# EAGLE schematic FluoWiFi_R01-RC (EAGLE 8.2.2)

## Sheet 1 of 2
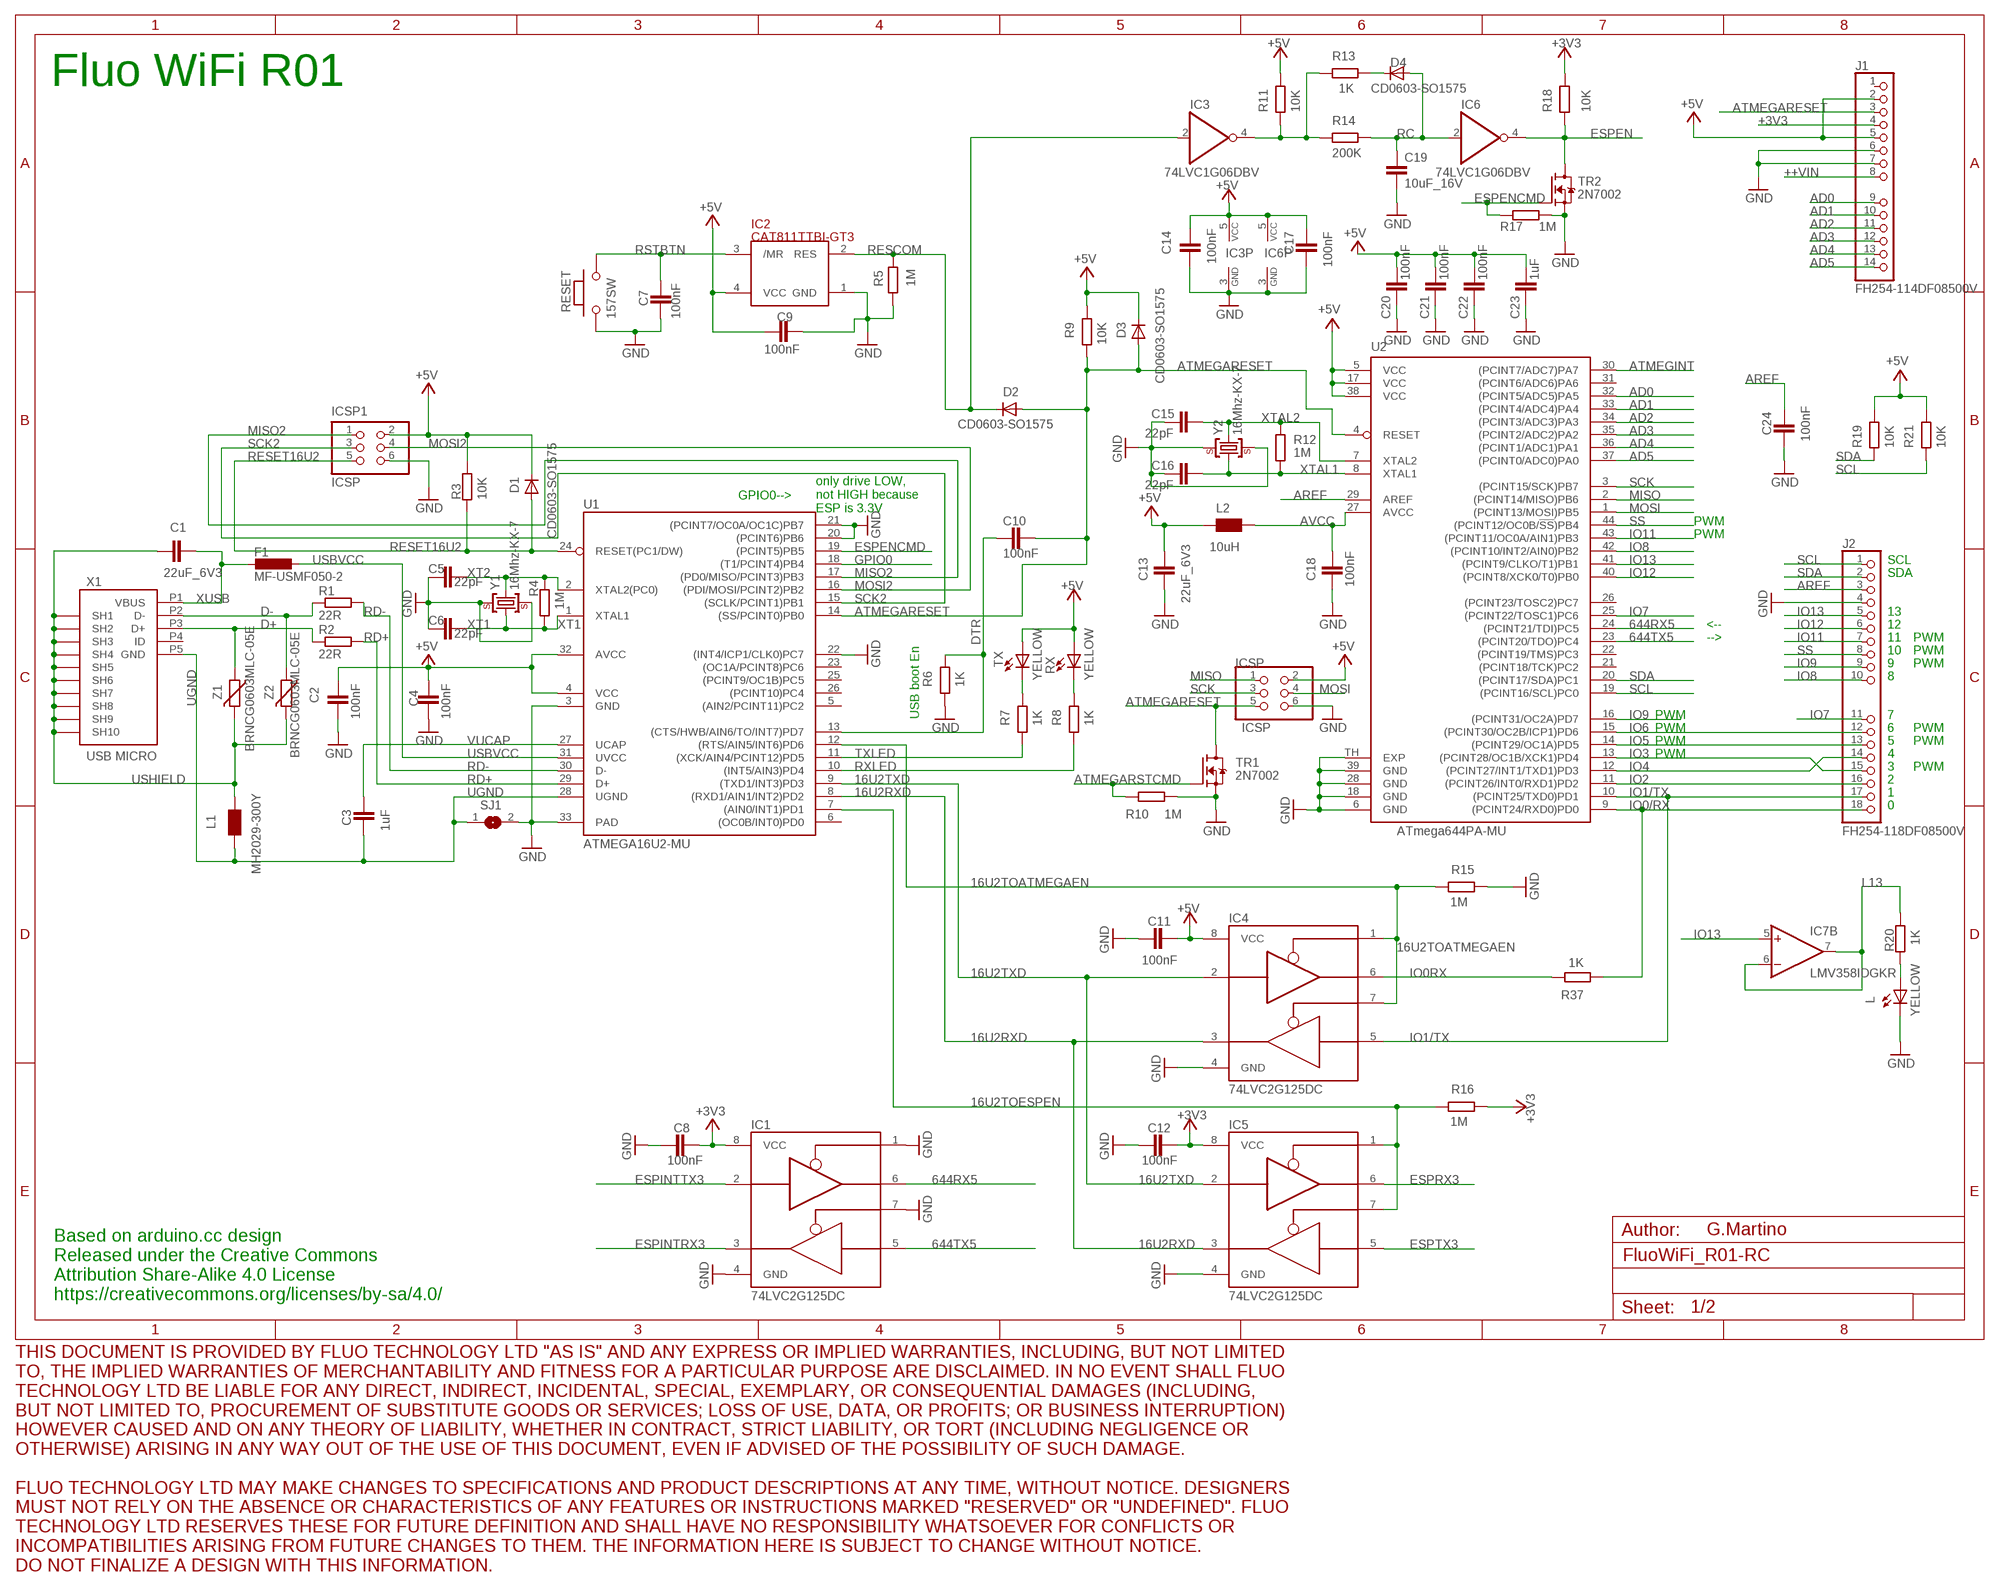
[diagram p0: schematic, sheet 1]

### Parts
C1  22uF_6V3  XXXX_GRM188R60J226MEA0D  [C0603-ROUND]
C2  100nF  0132_100NF_0402  [C0402]
C3  1uF  0133_1UF_0402  [C0402]
C4  100nF  0132_100NF_0402  [C0402]
C5  22pF  0137_22PF_0402  [C0402]
C6  22pF  0137_22PF_0402  [C0402]
C7  100nF  0132_100NF_0402  [C0402]
C8  100nF  0132_100NF_0402  [C0402]
C9  100nF  0132_100NF_0402  [C0402]
C10  100nF  0132_100NF_0402  [C0402]
C11  100nF  0132_100NF_0402  [C0402]
C12  100nF  0132_100NF_0402  [C0402]
C13  22uF_6V3  XXXX_GRM188R60J226MEA0D  [C0603-ROUND]
C14  100nF  0132_100NF_0402  [C0402]
C15  22pF  0137_22PF_0402  [C0402]
C16  22pF  0137_22PF_0402  [C0402]
C17  100nF  0132_100NF_0402  [C0402]
C18  100nF  0132_100NF_0402  [C0402]
C19  10uF_16V  XXXX_10UF_16V_0805C0805_ROUND  [C0805_ROUND]
C20  100nF  0132_100NF_0402  [C0402]
C21  100nF  0132_100NF_0402  [C0402]
C22  100nF  0132_100NF_0402  [C0402]
C23  1uF  0133_1UF_0402  [C0402]
C24  100nF  0132_100NF_0402  [C0402]
D1  CD0603-SO1575  XXXX_CD0603-SO1575  [0603]
D2  CD0603-SO1575  XXXX_CD0603-SO1575  [0603]
D3  CD0603-SO1575  XXXX_CD0603-SO1575  [0603]
D4  CD0603-SO1575  XXXX_CD0603-SO1575  [0603]
F1  MF-USMF050-2  XXXX_MF-USMF050-2  [1210]
IC1  74LVC2G125DC  XXXX_74LVC2G125DC  [VSSOP8]
IC2  CAT811TTBI-GT3  0035_CAT811TTBI-GT3  [SOT143]
IC3  74LVC1G06DBV  [SOT23-5]
IC4  74LVC2G125DC  XXXX_74LVC2G125DC  [VSSOP8]
IC5  74LVC2G125DC  XXXX_74LVC2G125DC  [VSSOP8]
IC6  74LVC1G06DBV  [SOT23-5]
IC7  LMV358IDGKR  0021_LMV358IDGKR  [MSOP08]
ICSP  ICSP  0114_PH254-203DF118A00V  [2X03]
ICSP1  ICSP  0114_PH254-203DF118A00V  [2X03]
J1  FH254-114DF08500V  XXXX_FH254-114DF08500V_FLUO  [1-14-TH-PRESSFIT]
J2  FH254-118DF08500V  XXXX_FH254-118DF08500V_FLUO  [1X18-TH-PRESSFIT]
L  YELLOW  XXXX_KPHHS-1005SYCK  [0402_CHIP_LED]
L1  MH2029-300Y  0001_BLM21PG300SN1D_/_MH2029-300Y  [0805]
L2  10uH  0715_CV201210-100K  [0805]
R1  22R  0468_22R_0402  [R0402]
R2  22R  0468_22R_0402  [R0402]
R3  10K  0136_CR0402FX1002_L  [R0402]
R4  1M  0139_1M_0402  [R0402]
R5  1M  0139_1M_0402  [R0402]
R6  1K  0140_1K_0402  [R0402]
R7  1K  0140_1K_0402  [R0402]
R8  1K  0140_1K_0402  [R0402]
R9  10K  0136_CR0402FX1002_L  [R0402]
R10  1M  0139_1M_0402  [R0402]
R11  10K  0136_CR0402FX1002_L  [R0402]
R12  1M  0139_1M_0402  [R0402]
R13  1K  0140_1K_0402  [R0402]
R14  200K  XXXX_CRT0402-BY-2003GLF  [R0402]
R15  1M  0139_1M_0402  [R0402]
R16  1M  0139_1M_0402  [R0402]
R17  1M  0139_1M_0402  [R0402]
R18  10K  0136_CR0402FX1002_L  [R0402]
R19  10K  0136_CR0402FX1002_L  [R0402]
R20  1K  0140_1K_0402  [R0402]
R21  10K  0136_CR0402FX1002_L  [R0402]
R37  1K  0140_1K_0402  [R0402]
RESET  157SW  0173_IT-1185AP1C-160G-G_T&R  [SMD_157SW]
RX  YELLOW  XXXX_KPHHS-1005SYCK  [0402_CHIP_LED]
SJ1  SJSJ_NO_RESIST  [SJ_NO_RESIST]
TR1  2N7002  1612_2N7002LT1G  [SOT-23]
TR2  2N7002  1612_2N7002LT1G  [SOT-23]
TX  YELLOW  XXXX_KPHHS-1005SYCK  [0402_CHIP_LED]
U1  ATMEGA16U2-MU  0007_ATMEGA16U2-MUR  [MLF32]
U2  ATmega644PA-MU  XXXX_ATMEGA644PA-MUM  [VQFN44]
U$1  DISCLAIMER-FLUO  [DISCLAIMER-FLUO]
X1  USB MICRO  0158_MCR-B-S-RA-SMT-CS1TR_HOLES  [CON2_USB_MICRO_B_AT_HOLES]
Y1  16Mhz-KX-7  0395_16.000MHZ__12PF  [CRYSTAL-3.2-2.5]
Y2  16Mhz-KX-7  0395_16.000MHZ__12PF  [CRYSTAL-3.2-2.5]
Z1  BRNCG0603MLC-05E  0010_BRNCG0603MLC-05E  [CT/CN0603]
Z2  BRNCG0603MLC-05E  0010_BRNCG0603MLC-05E  [CT/CN0603]

### Nets
16U2RXD: IC4.3(2Y) IC5.3(2Y) U1.8((RXD1/AIN1/INT2)PD2)
16U2TOATMEGAEN: IC4.1(OE1) IC4.7(OE2) R15.2 U1.12((RTS/AIN5/INT6)PD6)
16U2TOESPEN: IC5.1(OE1) IC5.7(OE2) R16.2 U1.7((AIN0/INT1)PD1)
16U2TXD: IC4.2(1A) IC5.2(1A) U1.9((TXD1/INT3)PD3)
644RX5: IC1.6(1Y) U2.24((PCINT21/TDI)PC5)
644TX5: IC1.5(2A) U2.23((PCINT20/TDO)PC4)
+3V3: C8.2 C12.1 IC1.8(VCC) IC5.8(VCC) J1.4 R16.1 R18.2 ; also sheet 2
+5V [usbvcc]: C2.1 C4.2 C9.1 C11.1 C13.2 C14.2 C17.2 C20.2 C21.2 C22.2 C23.1 D1.C D3.C IC2.4(VCC) IC3.5(VCC) IC4.8(VCC) IC6.5(VCC) ICSP1.2 ICSP.2 J1.2 J1.5 L2.1 R3.2 R9.2 R11.2 R19.2 R21.2 RX.A TX.A U1.4(VCC) U1.32(AVCC) U2.5(VCC) U2.17(VCC) U2.38(VCC) ; also sheet 2
++VIN [power]: J1.8 ; also sheet 2
AD0: J1.9 U2.32((PCINT5/ADC5)PA5)
AD1: J1.10 U2.33((PCINT4/ADC4)PA4)
AD2: J1.11 U2.34((PCINT3/ADC3)PA3)
AD3: J1.12 U2.35((PCINT2/ADC2)PA2)
AD4: J1.13 U2.36((PCINT1/ADC1)PA1)
AD5: J1.14 U2.37((PCINT0/ADC0)PA0)
AREF [aref]: C24.2 J2.3 U2.29(AREF)
ATMEGARESET: C10.2 D2.A D3.A ICSP.5 J1.3 R9.1 TR1.3(D) U1.14((SS/PCINT0)PB0) U2.4(RESET)
ATMEGARSTCMD: R10.1 TR1.1(G) ; also sheet 2
ATMEGINT: U2.30((PCINT7/ADC7)PA7) ; also sheet 2
AVCC: C18.2 L2.2 U2.27(AVCC)
D+: R2.1 X1.P3(D+) Z1.1
D-: R1.1 X1.P2(D-) Z2.1
DTR: C10.1 R6.2 U1.13((CTS/HWB/AIN6/TO/INT7)PD7)
ESPEN: IC6.4(O) R18.1 TR2.3(D) ; also sheet 2
ESPENCMD: R17.1 TR2.1(G) U1.19((PCINT5)PB5)
ESPINTRX3: IC1.3(2Y) ; also sheet 2
ESPINTTX3: IC1.2(1A) ; also sheet 2
ESPRX3: IC5.6(1Y) ; also sheet 2
ESPTX3: IC5.5(2A) ; also sheet 2
GND [gnd]: C2.2 C4.1 C5.2 C6.2 C7.1 C8.1 C9.2 C11.2 C12.2 C13.1 C14.1 C15.2 C16.2 C17.1 C18.1 C19.2 C20.1 C21.1 C22.1 C23.2 C24.1 IC1.1(OE1) IC1.4(GND) IC1.7(OE2) IC2.1(GND) IC3.3(GND) IC4.4(GND) IC5.4(GND) IC6.3(GND) ICSP1.6 ICSP.6 J1.6 J1.7 J2.4 L.C R5.1 R6.1 R10.2 R15.1 R17.2 RESET.1 SJ1.2 TR1.2(S) TR2.2(S) U1.3(GND) U1.20((PCINT6)PB6) U1.21((PCINT7/OC0A/OC1C)PB7) U1.22((INT4/ICP1/CLK0)PC7) U1.33(PAD) U2.6(GND) U2.18(GND) U2.28(GND) U2.39(GND) U2.TH(EXP) Y1.2(GND) Y1.4(GND) Y2.2(GND) Y2.4(GND) ; also sheet 2
GPIO0: U1.18((T1/PCINT4)PB4) ; also sheet 2
IO0/RX: J2.18 R37.1 U2.9((PCINT24/RXD0)PD0)
IO0RX: IC4.6(1Y) R37.2
IO1/TX: IC4.5(2A) J2.17 U2.10((PCINT25/TXD0)PD1)
IO2: J2.16 U2.11((PCINT26/INT0/RXD1)PD2)
IO3: J2.15 U2.13((PCINT28/OC1B/XCK1)PD4)
IO4: J2.14 U2.12((PCINT27/INT1/TXD1)PD3)
IO5: J2.13 U2.14((PCINT29/OC1A)PD5)
IO6: J2.12 U2.15((PCINT30/OC2B/ICP1)PD6)
IO7: J2.11 U2.25((PCINT22/TOSC1)PC6)
IO8: J2.10 U2.42((PCINT10/INT2/AIN0)PB2)
IO9: J2.9 U2.16((PCINT31/OC2A)PD7)
IO11: J2.7 U2.43((PCINT11/OC0A/AIN1)PB3)
IO12: J2.6 U2.40((PCINT8/XCK0/T0)PB0)
IO13: IC7.5(B:+IN) J2.5 U2.41((PCINT9/CLKO/T1)PB1)
L13: IC7.6(B:-IN) IC7.7(B:OUT) R20.2
MISO: ICSP.1 U2.2((PCINT14/MISO)PB6) ; also sheet 2
MISO2: ICSP1.1 U1.17((PD0/MISO/PCINT3)PB3)
MOSI: ICSP.4 U2.1((PCINT13/MOSI)PB5) ; also sheet 2
MOSI2: ICSP1.4 U1.16((PDI/MOSI/PCINT2)PB2)
N$6: IC3.4(O) R11.1 R13.1 R14.2
N$7: D4.C R13.2
N$14: R7.2 TX.C
N$15: R8.2 RX.C
N$21: L.A R20.1
RC: C19.1 D4.A IC6.2(I) R14.1
RD+: R2.2 U1.29(D+)
RD-: R1.2 U1.30(D-)
RESCOM: D2.C IC2.2(RES) IC3.2(I) R5.2
RESET16U2: D1.A ICSP1.5 R3.1 U1.24(RESET(PC1/DW))
RSTBTN: C7.2 IC2.3(/MR) RESET.2
RXLED: R8.1 U1.10((INT5/AIN3)PD4)
SCK: ICSP.3 U2.3((PCINT15/SCK)PB7) ; also sheet 2
SCK2: ICSP1.3 U1.15((SCLK/PCINT1)PB1)
SCL: J2.1 R21.1 U2.19((PCINT16/SCL)PC0)
SDA: J2.2 R19.1 U2.20((PCINT17/SDA)PC1)
SS: J2.8 U2.44((PCINT12/OC0B/!SS!)PB4)
TXLED: R7.1 U1.11((XCK/AIN4/PCINT12)PD5)
UGND [gnd]: C3.2 L1.1 SJ1.1 U1.28(UGND) X1.P5(GND)
USBVCC [usbvcc]: F1.1 U1.31(UVCC) ; also sheet 2
USHIELD [usbvcc]: C1.2 L1.2 X1.P$2(SH7) X1.P$3(SH8) X1.P$6(SH9) X1.P$7(SH10) X1.S1(SH1) X1.S2(SH2) X1.S3(SH3) X1.S4(SH4) X1.S5(SH5) X1.S6(SH6) Z1.2 Z2.2
VUCAP: C3.1 U1.27(UCAP)
XT1: C6.1 R4.1 U1.1(XTAL1) Y1.1(C1)
XT2: C5.1 R4.2 U1.2(XTAL2(PC0)) Y1.3(C2)
XTAL1: C16.1 R12.1 U2.8(XTAL1) Y2.1(C1)
XTAL2: C15.1 R12.2 U2.7(XTAL2) Y2.3(C2)
XUSB [usbvcc]: C1.1 F1.2 X1.P1(VBUS)
Unconnected: J1.1 U1.5((AIN2/PCINT11)PC2) U1.6((OC0B/INT0)PD0) U1.23((OC1A/PCINT8)PC6) U1.25((PCINT9/OC1B)PC5) U1.26((PCINT10)PC4) U2.21((PCINT18/TCK)PC2) U2.22((PCINT19/TMS)PC3) U2.26((PCINT23/TOSC2)PC7) U2.31((PCINT6/ADC6)PA6) X1.P4(ID)

### Notes on the sheet
- Fluo WiFi R01
- GPIO0-->
- only drive LOW, 
  not HIGH because 
  ESP is 3.3V
- PWM
- PWM
- SCL
- SDA
- 13
- <-- | 12
- --> | 11 | PWM
- 10 | PWM
- 9 | PWM
- 8
- USB boot En | PWM | 7
- PWM | 6 | PWM
- PWM | 5 | PWM
- PWM | 4
- 3 | PWM
- 2
- 1
- 0
- G.Martino
- Based on arduino.cc design
  Released under the Creative Commons
  Attribution Share-Alike 4.0 License
  https://creativecommons.org/licenses/by-sa/4.0/

## Sheet 2 of 2
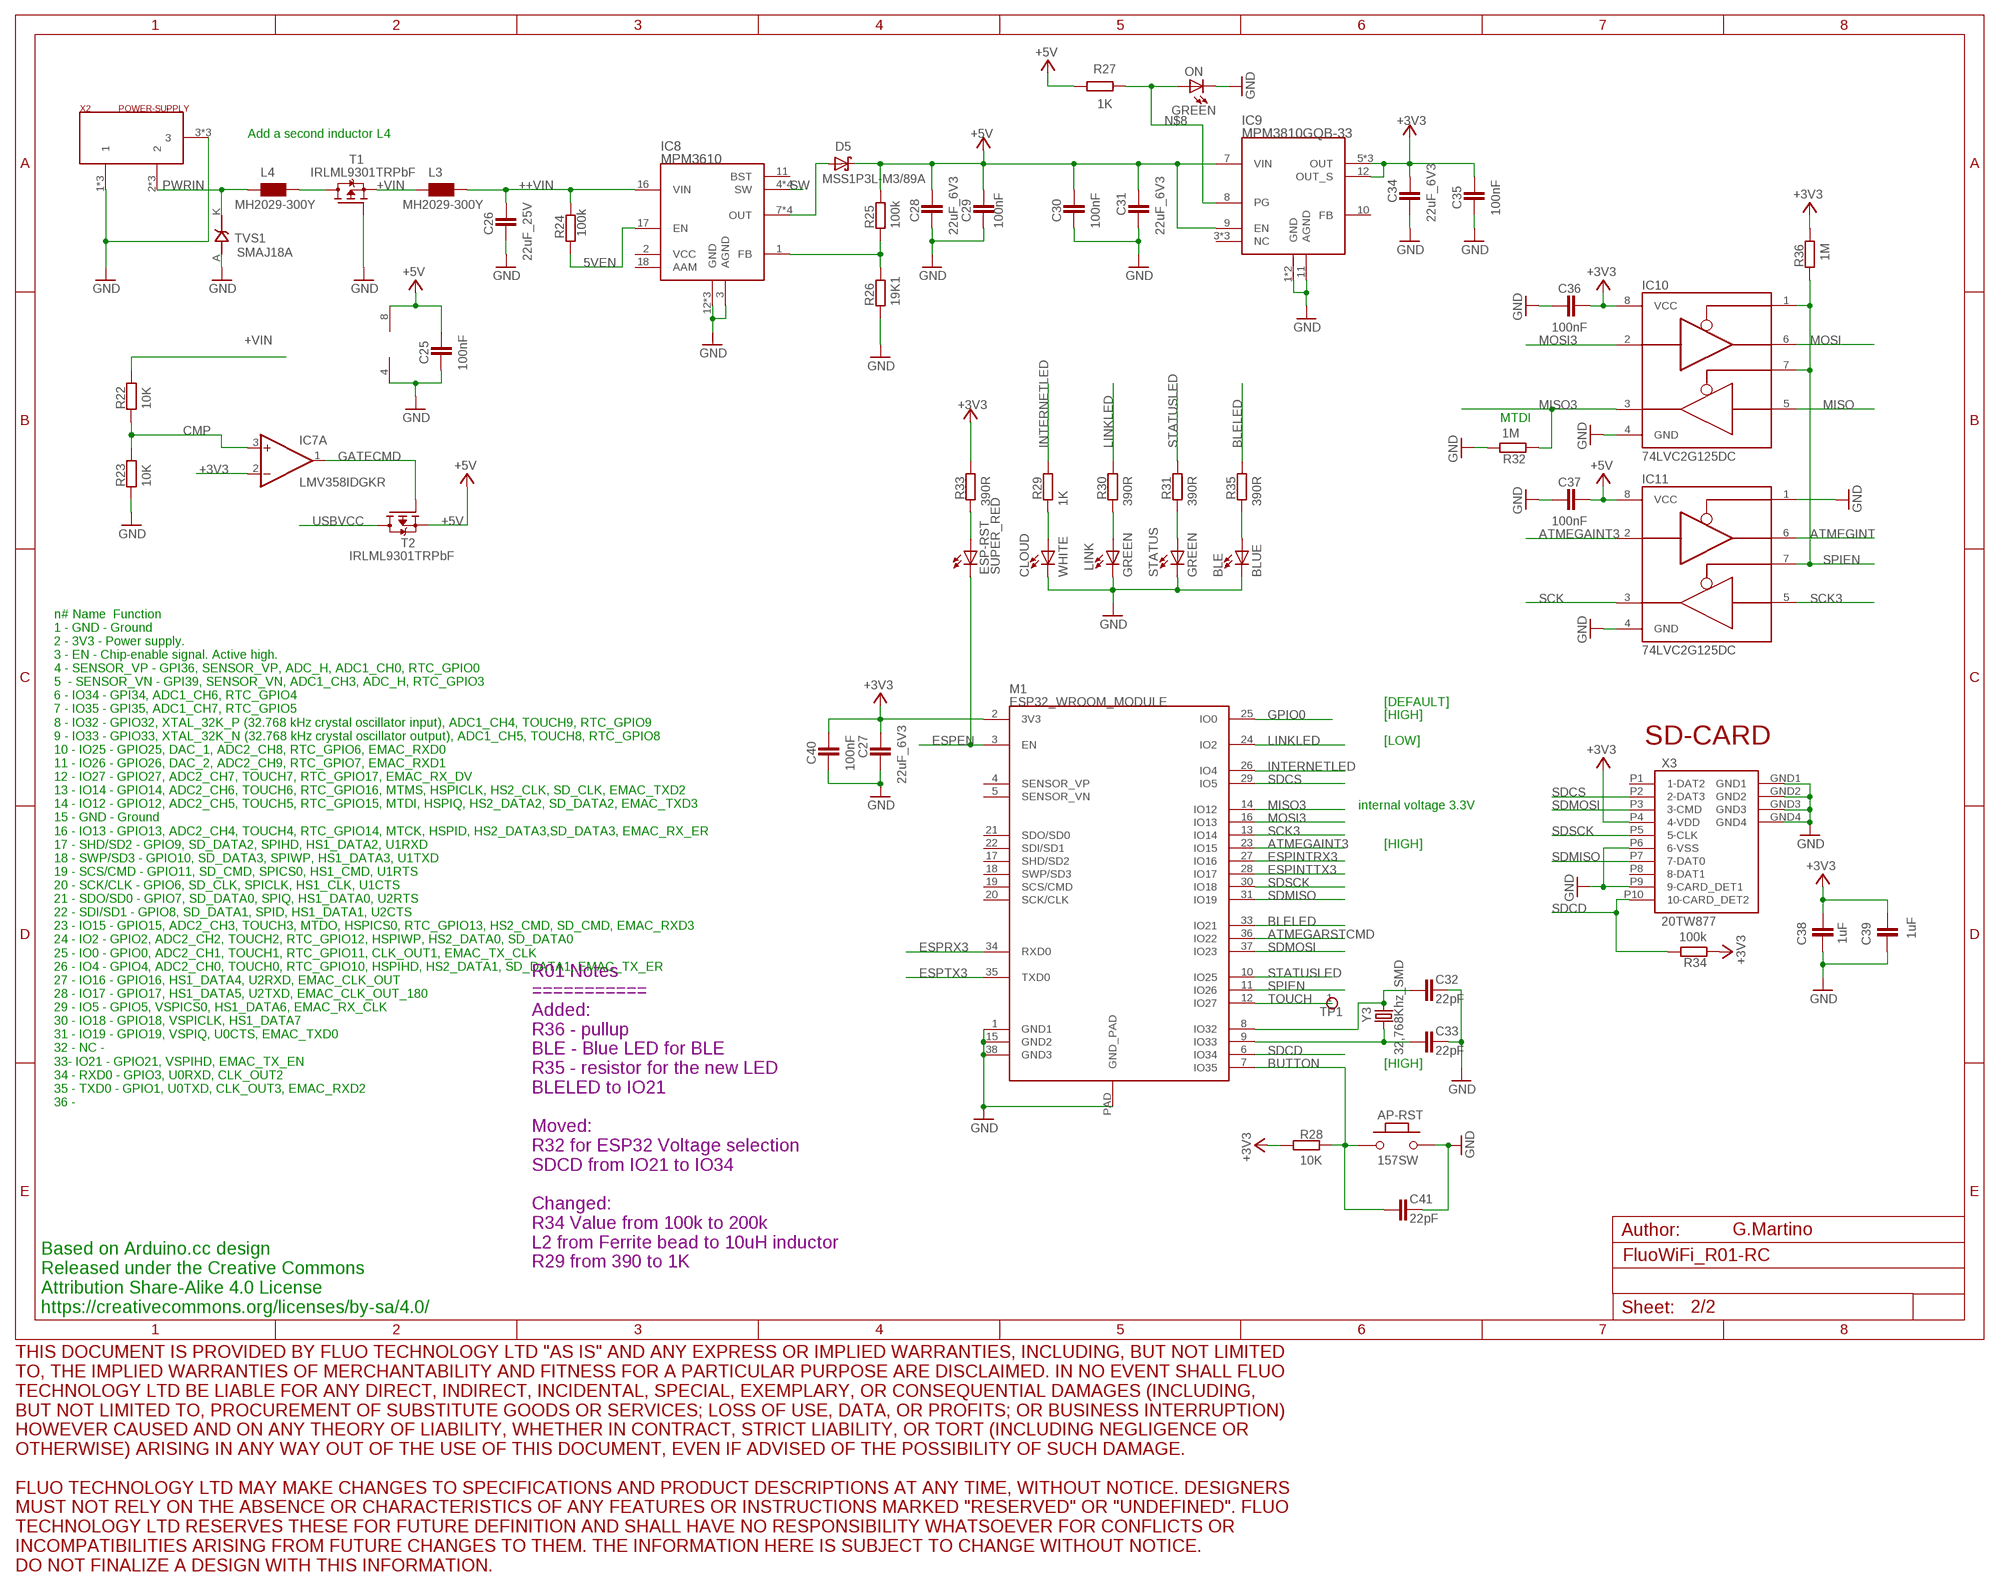
[diagram p1: schematic, sheet 2]

### Parts
AP-RST  157SW  0173_IT-1185AP1C-160G-G_T&R  [SMD_157SW]
BLE  BLUE  XXXX_KPHHS-1005QBC-D-V  [0402_CHIP_LED]
C25  100nF  0132_100NF_0402  [C0402]
C26  22uF_25V  XXXX_GRM219R61C226ME15K  [C0805_ROUND]
C27  22uF_6V3  XXXX_GRM188R60J226MEA0D  [C0603-ROUND]
C28  22uF_6V3  XXXX_GRM188R60J226MEA0D  [C0603-ROUND]
C29  100nF  0132_100NF_0402  [C0402]
C30  100nF  0132_100NF_0402  [C0402]
C31  22uF_6V3  XXXX_GRM188R60J226MEA0D  [C0603-ROUND]
C32  22pF  0137_22PF_0402  [C0402]
C33  22pF  0137_22PF_0402  [C0402]
C34  22uF_6V3  XXXX_GRM188R60J226MEA0D  [C0603-ROUND]
C35  100nF  0132_100NF_0402  [C0402]
C36  100nF  0132_100NF_0402  [C0402]
C37  100nF  0132_100NF_0402  [C0402]
C38  1uF  0133_1UF_0402  [C0402]
C39  1uF  0133_1UF_0402  [C0402]
C40  100nF  0132_100NF_0402  [C0402]
C41  22pF  0137_22PF_0402  [C0402]
CLOUD  WHITE  XXXX_KPHHS-1005QWF-D-V  [0402_CHIP_LED]
D5  MSS1P3L-M3/89A  1653_MSS1P3L-M3/89A  [MICROSMP]
ESP-RST  SUPER_RED  XXXX_KPHHS-1005SURCK  [0402_CHIP_LED]
IC8  MPM3610  2093_MPM3610GQV-P  [QFN-20]
IC9  MPM3810GQB-33  2068_MPM3810GQB-33  [QFN-12]
IC10  74LVC2G125DC  XXXX_74LVC2G125DC  [VSSOP8]
IC11  74LVC2G125DC  XXXX_74LVC2G125DC  [VSSOP8]
L3  MH2029-300Y  0001_BLM21PG300SN1D_/_MH2029-300Y  [0805]
L4  MH2029-300Y  0001_BLM21PG300SN1D_/_MH2029-300Y  [0805]
LINK  GREEN  FT4001_KPHHS-1005CGCK  [0402_CHIP_LED]
M1  ESP32_WROOM_MODULE  [WROOM_ESP32]
ON  GREEN  XXXX_KPHHS-1005CGCK  [0402_CHIP_LED]
R22  10K  0136_CR0402FX1002_L  [R0402]
R23  10K  0136_CR0402FX1002_L  [R0402]
R24  100k  0134_CR0402FX1003L  [R0402]
R25  100k  0134_CR0402FX1003L  [R0402]
R26  19K1  XXXX_CRCW040219K1FKED  [R0402]
R27  1K  0140_1K_0402  [R0402]
R28  10K  0136_CR0402FX1002_L  [R0402]
R29  1K  0140_1K_0402  [R0402]
R30  390R  FT1008_CPF0402B390RE1  [R0402]
R31  390R  XXXX_CPF0402B390RE1  [R0402]
R32  1M  0139_1M_0402  [R0402]
R33  390R  XXXX_CPF0402B390RE1  [R0402]
R34  100k  0134_CR0402FX1003L  [R0402]
R35  390R  XXXX_CPF0402B390RE1  [R0402]
R36  1M  0139_1M_0402  [R0402]
STATUS  GREEN  XXXX_KPHHS-1005CGCK  [0402_CHIP_LED]
T1  IRLML9301TRPbF  FT3002_IRLML9301TRPBF  [SOT-23]
T2  IRLML9301TRPbF  XXXX_IRLML9301TRPBF  [SOT-23]
TP1  XXXX_TEST-POINTS_50  [TEST_50]
TVS1  SMAJ18A  XXXX_SMAJ18A  [SMA-TVS]
U$2  DISCLAIMER-FLUO  [DISCLAIMER-FLUO]
X2  POWER-SUPPLY  0018_19746-POWER-SUPPLY  [POWERSUPPLY_DC-21MM]
X3  20TW877  XXXX_20TW877  [20TW877_CARD_CONNECTOR]
Y3  32,768Khz_SMD  0213_ABS07-32.768KHZ-T  [RESONATOR_EPSON_FC_145]

### Nets
5VEN: IC8.17(EN) R24.2
+3V3: C27.1 C34.1 C35.2 C36.1 C38.2 C39.2 C40.2 IC7.2(A:-IN) IC9.5(OUT) IC9.6(OUT) IC9.12(OUT_S) IC9.14(OUT) IC10.8(VCC) M1.2(3V3) R28.2 R33.2 R34.1 R36.1 X3.P4(4-VDD) ; also sheet 1
+5V [usbvcc]: C25.2 C28.1 C29.1 C30.1 C31.1 C37.1 D5.K(C) IC7.8(P:V+) IC9.7(VIN) IC9.9(EN) IC11.8(VCC) R25.2 R27.2 T2.2(S) ; also sheet 1
+5V_SEZ [usbvcc]: D5.A IC8.7(OUT) IC8.8(OUT) IC8.9(OUT) IC8.20(OUT)
++VIN [power]: C26.1 IC8.16(VIN) L3.2 R24.1 ; also sheet 1
+VIN: L3.1 R22.2 T1.2(S)
ATMEGAINT3: IC11.2(1A) M1.23(IO15)
ATMEGARSTCMD: M1.36(IO22) ; also sheet 1
ATMEGINT: IC11.6(1Y) ; also sheet 1
BLELED: M1.33(IO21) R35.2
BUTTON: AP-RST.1 C41.1 M1.7(IO35) R28.1
CMP: IC7.3(A:+IN) R22.1 R23.2
ESPEN: ESP-RST.C M1.3(EN) ; also sheet 1
ESPINTRX3: M1.27(IO16) ; also sheet 1
ESPINTTX3: M1.28(IO17) ; also sheet 1
ESPRX3: M1.34(RXD0) ; also sheet 1
ESPTX3: M1.35(TXD0) ; also sheet 1
GATECMD: IC7.1(A:OUT) T2.1(G)
GND [gnd]: AP-RST.2 BLE.C C25.1 C26.2 C27.2 C28.2 C29.2 C30.2 C31.2 C32.2 C33.2 C34.2 C35.1 C36.2 C37.2 C38.1 C39.1 C40.1 C41.2 CLOUD.C IC7.4(P:V-) IC8.3(AGND) IC8.12(GND) IC8.13(GND) IC8.14(GND) IC9.1(GND) IC9.2(GND) IC9.11(AGND) IC10.4(GND) IC11.1(OE1) IC11.4(GND) LINK.C M1.1(GND1) M1.15(GND2) M1.38(GND3) M1.PAD(GND_PAD) ON.C R23.1 R26.1 R32.1 STATUS.C T1.1(G) TVS1.A X2.1 X2.3 X2.4 X2.5 X2.6 X2.7 X3.GND1 X3.GND2 X3.GND3 X3.GND4 X3.P6(6-VSS) X3.P9(9-CARD_DET1) ; also sheet 1
GPIO0: M1.25(IO0) ; also sheet 1
INTERNETLED: M1.26(IO4) R29.2
LINKLED: M1.24(IO2) R30.2
MISO: IC10.5(2A) ; also sheet 1
MISO3: IC10.3(2Y) M1.14(IO12) R32.2
MOSI: IC10.6(1Y) ; also sheet 1
MOSI3: IC10.2(1A) M1.16(IO13)
N$1: ESP-RST.A R33.1
N$2: L4.2 T1.3(D)
N$3: BLE.A R35.1
N$4: CLOUD.A R29.1
N$8 [gnd]: IC9.8(PG) ON.A R27.1
N$9: C32.1 M1.8(IO32) Y3.P$2
N$10: C33.1 M1.9(IO33) Y3.P$1
N$12: LINK.A R30.1
N$13: R31.1 STATUS.A
N$160: IC8.1(FB) R25.1 R26.2
PWRIN [power]: L4.1 TVS1.K X2.2 X2.8 X2.9
SCK: IC11.3(2Y) ; also sheet 1
SCK3: IC11.5(2A) M1.13(IO14)
SDCD: M1.6(IO34) R34.2 X3.P10(10-CARD_DET2)
SDCS: M1.29(IO5) X3.P2(2-DAT3)
SDMISO: M1.31(IO19) X3.P7(7-DAT0)
SDMOSI: M1.37(IO23) X3.P3(3-CMD)
SDSCK: M1.30(IO18) X3.P5(5-CLK)
SPIEN [gnd]: IC10.1(OE1) IC10.7(OE2) IC11.7(OE2) M1.11(IO26) R36.2
STATUSLED: M1.10(IO25) R31.2
SW: IC8.4(SW) IC8.5(SW) IC8.6(SW) IC8.19(SW)
TOUCH: M1.12(IO27) TP1.1
USBVCC [usbvcc]: T2.3(D) ; also sheet 1
Unconnected: IC8.2(VCC) IC8.11(BST) IC8.18(AAM) IC9.3(NC) IC9.4(NC) IC9.10(FB) IC9.13(NC) M1.4(SENSOR_VP) M1.5(SENSOR_VN) M1.17(SHD/SD2) M1.18(SWP/SD3) M1.19(SCS/CMD) M1.20(SCK/CLK) M1.21(SDO/SD0) M1.22(SDI/SD1) X3.P1(1-DAT2) X3.P8(8-DAT1)

### Notes on the sheet
- Add a second inductor L4
- MTDI
- [DEFAULT]
- [HIGH]
- [LOW] | SD-CARD
- internal voltage 3.3V
- [HIGH]
- R01 Notes
  ===========
  Added:
  R36 - pullup
  BLE - Blue LED for BLE
  R35 - resistor for the new LED
  BLELED to IO21
  
  Moved: 
  R32 for ESP32 Voltage selection
  SDCD from IO21 to IO34
  
  Changed:
  R34 Value from 100k to 200k
  L2 from Ferrite bead to 10uH inductor
  R29 from 390 to 1K
- [HIGH]
- n# Name  Function
  1 - GND - Ground
  2 - 3V3 - Power supply.
  3 - EN - Chip-enable signal. Active high.
  4 - SENSOR_VP - GPI36, SENSOR_VP, ADC_H, ADC1_CH0, RTC_GPIO0
  5  - SENSOR_VN - GPI39, SENSOR_VN, ADC1_CH3, ADC_H, RTC_GPIO3
  6 - IO34 - GPI34, ADC1_CH6, RTC_GPIO4
  7 - IO35 - GPI35, ADC1_CH7, RTC_GPIO5
  8 - IO32 - GPIO32, XTAL_32K_P (32.768 kHz crystal oscillator input), ADC1_CH4, TOUCH9, RTC_GPIO9
  9 - IO33 - GPIO33, XTAL_32K_N (32.768 kHz crystal oscillator output), ADC1_CH5, TOUCH8, RTC_GPIO8
  10 - IO25 - GPIO25, DAC_1, ADC2_CH8, RTC_GPIO6, EMAC_RXD0
  11 - IO26 - GPIO26, DAC_2, ADC2_CH9, RTC_GPIO7, EMAC_RXD1
  12 - IO27 - GPIO27, ADC2_CH7, TOUCH7, RTC_GPIO17, EMAC_RX_DV
  13 - IO14 - GPIO14, ADC2_CH6, TOUCH6, RTC_GPIO16, MTMS, HSPICLK, HS2_CLK, SD_CLK, EMAC_TXD2
  14 - IO12 - GPIO12, ADC2_CH5, TOUCH5, RTC_GPIO15, MTDI, HSPIQ, HS2_DATA2, SD_DATA2, EMAC_TXD3
  15 - GND - Ground
  16 - IO13 - GPIO13, ADC2_CH4, TOUCH4, RTC_GPIO14, MTCK, HSPID, HS2_DATA3,SD_DATA3, EMAC_RX_ER
  17 - SHD/SD2 - GPIO9, SD_DATA2, SPIHD, HS1_DATA2, U1RXD
  18 - SWP/SD3 - GPIO10, SD_DATA3, SPIWP, HS1_DATA3, U1TXD
  19 - SCS/CMD - GPIO11, SD_CMD, SPICS0, HS1_CMD, U1RTS
  20 - SCK/CLK - GPIO6, SD_CLK, SPICLK, HS1_CLK, U1CTS
  21 - SDO/SD0 - GPIO7, SD_DATA0, SPIQ, HS1_DATA0, U2RTS
  22 - SDI/SD1 - GPIO8, SD_DATA1, SPID, HS1_DATA1, U2CTS
  23 - IO15 - GPIO15, ADC2_CH3, TOUCH3, MTDO, HSPICS0, RTC_GPIO13, HS2_CMD, SD_CMD, EMAC_RXD3
  24 - IO2 - GPIO2, ADC2_CH2, TOUCH2, RTC_GPIO12, HSPIWP, HS2_DATA0, SD_DATA0
  25 - IO0 - GPIO0, ADC2_CH1, TOUCH1, RTC_GPIO11, CLK_OUT1, EMAC_TX_CLK
  26 - IO4 - GPIO4, ADC2_CH0, TOUCH0, RTC_GPIO10, HSPIHD, HS2_DATA1, SD_DATA1, EMAC_TX_ER
  27 - IO16 - GPIO16, HS1_DATA4, U2RXD, EMAC_CLK_OUT
  28 - IO17 - GPIO17, HS1_DATA5, U2TXD, EMAC_CLK_OUT_180
  29 - IO5 - GPIO5, VSPICS0, HS1_DATA6, EMAC_RX_CLK
  30 - IO18 - GPIO18, VSPICLK, HS1_DATA7
  31 - IO19 - GPIO19, VSPIQ, U0CTS, EMAC_TXD0
  32 - NC - 
  33- IO21 - GPIO21, VSPIHD, EMAC_TX_EN
  34 - RXD0 - GPIO3, U0RXD, CLK_OUT2
  35 - TXD0 - GPIO1, U0TXD, CLK_OUT3, EMAC_RXD2
  36 - IO22 - GPIO22, VSPIWP, U0RTS, EMAC_TXD1
  37 - IO23 - GPIO23, VSPID, HS1_STROBE
  38 - GND - Ground
- G.Martino
- Based on Arduino.cc design
  Released under the Creative Commons
  Attribution Share-Alike 4.0 License
  https://creativecommons.org/licenses/by-sa/4.0/

## Library data of the parts
AP-RST RESET = Switches:0173_IT-1185AP1C-160G-G_T&R: Pushbutton 4x3 SMD H2,5mm; MONTHLY_USAGE: _____; PART_NUMBER: IT-1185AP1C-160G-G_T&R; PRICE: _____; SUPPLIER: _____; TYPE: Switches
BLE = Opto:XXXX_KPHHS-1005QBC-D-V: 0402 small-scale, high brightness LED. Wavelength (470 to 475) nm (blue).; CASE: 0402; PART_NUMBER: KPHHS-1005QBC-D-V; TYPE: LED
C1 C13 C27 C28 C31 C34 = Condensatori:XXXX_GRM188R60J226MEA0D: 22Uf 6v3 0603; CASE: 0603; PART_NUMBER: GRM188R60J226MEA0D; TYPE: Condensatori
C2 C4 C7-C12 C14 C17 C18 C20-C22 C24 C25 C29 C30 C35-C37 C40 = Condensatori:0132_100NF_0402: 100nF 0402; CASE: 0402; MONTHLY_USAGE: _____; PART_NUMBER: 100nF_0402; PRICE: _____; SUPPLIER: _____; TYPE: Condensatori
C3 C23 C38 C39 = Condensatori:0133_1UF_0402: 1uF 0402; CASE: 0402; MONTHLY_USAGE: _____; PART_NUMBER: 1uF_0402; PRICE: _____; SUPPLIER: _____; TYPE: Condensatori
C5 C6 C15 C16 C32 C33 C41 = Condensatori:0137_22PF_0402: 22pF 0402; CASE: 0402; MONTHLY_USAGE: _____; PART_NUMBER: 22pF_0402; PRICE: _____; SUPPLIER: _____; TYPE: Condensatori
C19 = Condensatori:XXXX_10UF_16V_0805: Murata 10uF 16V 0805; CASE: 0805; PART_NUMBER: GRM21BR61C106KE15L; TYPE: Condensatori
C26 = Condensatori:XXXX_GRM219R61C226ME15K: 22uF/16V - Multilayer Ceramic Capacitors MLCC - SMD/SMT; CASE: 0805; PART_NUMBER: GRM219R61C226ME15K; TYPE: capcacitor; VALUE: 22uF_16V
CLOUD = Opto:XXXX_KPHHS-1005QWF-D-V: 0402 small-scale, high brightness LED. Typical color temperature 7000 K. Chromaticity coordinated group S1 to S6.; CASE: 0402; PART_NUMBER: KPHHS-1005QWF-D-V; TYPE: LED
D1-D4 = Diodi:XXXX_CD0603-SO1575: Switching Chip Diode Series - 0603; CASE: 0603; PART_NUMBER: CD0603-SO1575; TYPE: Diodi
D5 = Diodi:1653_MSS1P3L-M3/89A: Surface Mount Schottky Barrier Rectifiers - Case microSMP
ESP-RST = Opto:XXXX_KPHHS-1005SURCK: 0402 small-scale, high brightness LED. Wavelength: typ. 631 nm (super red).; CASE: 0402; PART_NUMBER: KPHHS-1005SURCK; TYPE: LED
F1 = Protezione:XXXX_MF-USMF050-2: MF-USMF Series - PTC Resettable Fuses; CASE: 1210; PART_NUMBER: MF-USMF050-2; TYPE: polyfuse
IC1 IC4 IC5 IC10 IC11 = IntegratedCircuits:XXXX_74LVC2G125DC: 74LVC2G125 Dual bus buffer/line driver; 3-state; CASE: VSSOP8; PART_NUMBER: 74LVC2G125DC; TYPE: Integrated Circuits
IC2 = IntegratedCircuits-2:0035_CAT811TTBI-GT3: 4-Pin Microprocessor Power Supply Supervisors- Reset Controller CAT811TTBI-GT3; CASE: SOT143-4; MONTHLY_USAGE: _____; PART_NUMBER: CAT811TTBI-GT3; PRICE: _____; SUPPLIER: _____; TYPE: Circuito_Integrato
IC3 IC6 = 74xx-little-de:74*1G06: Single Inverter Buffer/Driver With Open-Drain Output
IC7 = IntegratedCircuits:0021_LMV358IDGKR: Dual low-voltage (2.7 V to 5.5 V), operational amplifiers with rail-to-rail output swing LMV358IDGKR; CASE: MSOP8; MONTHLY_USAGE: _____; PART_NUMBER: LMV358IDGKR; PRICE: _____; SUPPLIER: _____; TYPE: Circuito_Integrato
IC8 = IntegratedCircuits:2093_MPM3610GQV-P: MPM3610 Step Down Regulator; CASE: QFN-20; PART_NUMBER: MPM3610GQV-P; TYPE: Circuito_Integrato
IC9 = IntegratedCircuits:2068_MPM3810GQB-33: MPM3810 6V Input, 1.2A Module Synchronous Step-Down Converter with Integrated Inductor; PART_NUMBER: MPM3810GQB-33
ICSP ICSP1 = Connettori:0114_PH254-203DF118A00V: 3x2 M V h 8,5 mm p2,54; MONTHLY_USAGE: _____; PART_NUMBER: PH254-203DF118A00V; PRICE: _____; SUPPLIER: _____; TYPE: Connettori
J1 = Connettori:XXXX_FH254-114DF08500V_FLUO: New Arduino 14 pin connector.; PART_NUMBER: FH254-114DF08500V; TYPE: Connetori
J2 = Connettori:XXXX_FH254-118DF08500V_FLUO: New Arduino 18 pin connector; PART_NUMBER: FH254-118DF08500V; TYPE: Connetori
L RX TX = Opto:XXXX_KPHHS-1005SYCK: 0402 small-scale, high brightness LED. Wavelength: (587 to 597) nm (yellow).; CASE: 0402; PART_NUMBER: KPHHS-1005SYCK; TYPE: LED
L1 L3 L4 = Protezione:0001_BLM21PG300SN1D_/_MH2029-300Y: BLM21; MONTHLY_USAGE: _____; PART_NUMBER: BLM21PG300SN1D_/_MH2029-300Y; PRICE: _____; SUPPLIER: _____; TYPE: Protezione
L2 = Induttanze:0715_CV201210-100K: 10uH 0805; CASE: 0805; MONTHLY_USAGE: _____; PART_NUMBER: CV201210-100K; PRICE: _____; SUPPLIER: _____; TYPE: Induttanze
LINK = Opto:FT4001_KPHHS-1005CGCK: 0402 small-scale, high brightness LED. Wavelength: typ. 605 nm (green).; CASE: 0402; PART_NUMBER: KPHHS-1005CGCK; TYPE: LED
M1 = Moduli:ESP32_WROOM_MODULE: ESP-WROOM-32 generic WiFi-BT-BLE MCU module; PART_NUMBER: ESP32_WROOM_MODULE; TYPE: Module
ON STATUS = Opto:XXXX_KPHHS-1005CGCK: 0402 small-scale, high brightness LED. Wavelength: typ. 605 nm (green).; CASE: 0402; PART_NUMBER: KPHHS-1005CGCK; TYPE: LED
R1 R2 = Resistenze:0468_22R_0402: 22R 0402; CASE: 0402; MONTHLY_USAGE: _____; PART_NUMBER: 22R_0402; PRICE: _____; SUPPLIER: _____; TYPE: Resistenze
R3 R9 R11 R18 R19 R21-R23 R28 = Resistenze:0136_CR0402FX1002_L: 10K 0402; CASE: 0402; MONTHLY_USAGE: _____; PART_NUMBER: CR0402FX1002_L; PRICE: _____; SUPPLIER: _____; TYPE: Resistenze
R4 R5 R10 R12 R15-R17 R32 R36 = Resistenze:0139_1M_0402: 1M 0402; CASE: 0402; MONTHLY_USAGE: _____; PART_NUMBER: 1M_0402; PRICE: _____; SUPPLIER: _____; TYPE: Resistenze
R6-R8 R13 R20 R27 R29 R37 = Resistenze:0140_1K_0402: 1K 0402; CASE: 0402; MONTHLY_USAGE: _____; PART_NUMBER: 1K_0402; PRICE: _____; SUPPLIER: _____; TYPE: Resistenze
R14 = Resistenze:XXXX_CRT0402-BY-2003GLF: 200K 0402; CASE: 0402; PART_NUMBER: CRT0402-BY-2003GLF; TYPE: RESISTOR
R24 R25 R34 = Resistenze:0134_CR0402FX1003L: 100K 0402; CASE: 0402; PART_NUMBER: CR0402FX1003 L; TYPE: Resistenze
R26 = Resistenze:XXXX_CRCW040219K1FKED: 19K1 0402; CASE: 0402; PART_NUMBER: CRCW040219K1FKED; TYPE: Resistenze
R30 = Resistenze:FT1008_CPF0402B390RE1: 390R_0402; CASE: 0402; PART_NUMBER: CPF0402B390RE1; TYPE: Resistenze
R31 R33 R35 = Resistenze:XXXX_CPF0402B390RE1: 390R_0402; CASE: 0402; PART_NUMBER: CPF0402B390RE1; TYPE: Resistenze
SJ1 = Misc:SJ: SMD solder JUMPER
T1 = Transistors:FT3002_IRLML9301TRPBF: PMOS; CASE: SOT-23; PART_NUMBER: IRLML9301TRPbF; TYPE: P-MOS
T2 = Transistors:XXXX_IRLML9301TRPBF: PMOS; CASE: SOT-23; PART_NUMBER: IRLML9301TRPbF; TYPE: P-MOS
TP1 = Misc:XXXX_TEST-POINTS: Test Pads
TR1 TR2 = Transistors:1612_2N7002LT1G: 2N7002 60 V, 300 mA N-channel Trench MOSFET
TVS1 = Protezione:XXXX_SMAJ18A: Unidirectional Transient Voltage Suppression Diodes; CASE: SMA-TVS; PART_NUMBER: SMAJ18A; TYPE: proteczione
U1 = IntegratedCircuits:0007_ATMEGA16U2-MUR: 8-bit Microcontroller with 16K Bytes of ISP Flash and USB Controller ATMEGA16U2-MUR; CASE: QFN32_5x5; MONTHLY_USAGE: _____; PART_NUMBER: ATMEGA16U2-MUR; PRICE: _____; SUPPLIER: _____; TYPE: Circuito_Integrato
U2 = IntegratedCircuits:XXXX_ATMEGA644PA-MU: 8-bit Microcontroller with 64K Bytes In-System Programmable Flash; CASE: VQFN44 (44M1); PART_NUMBER: ATmega644PA-MU; TYPE: Circuito_Integrato; VALUE: ATmega644PA
U$1 U$2 = Misc:DISCLAIMER-FLUO
X1 = Connettori:0158_MCR-B-S-RA-SMT-CS1TR: Usb Micro F/90 Smd Tipo B; PART_NUMBER: MCR-B-S-RA-SMT-CS1TR; VALUE: MCR-B-S-RA-SMT-CS1TR
X2 = Connettori:0018_19746-POWER-SUPPLY: JACK; MONTHLY_USAGE: _____; PART_NUMBER: 19746; PRICE: _____; SUPPLIER: _____; TYPE: Connettori
X3 = Connettori:XXXX_20TW877: -20TW877 Micro SD connector push-push con detect; PART_NUMBER: 20TW877; TYPE: Conettori
Y1 Y2 = Cristalli:0395_16.000MHZ__12PF: 16Mhz - K7 12pF - SMD; MONTHLY_USAGE: _____; PART_NUMBER: 16.000Mhz__12pF; PRICE: _____; SUPPLIER: _____; TYPE: Cristalli
Y3 = Cristalli:0213_ABS07-32.768KHZ-T: 32,768KHz - SMD; MONTHLY_USAGE: _____; PART_NUMBER: ABS07-32.768KHZ-T; PRICE: _____; SUPPLIER: _____; TYPE: Cristalli
Z1 Z2 = Protezione:0010_BRNCG0603MLC-05E: CG0603MLC-05E; MONTHLY_USAGE: _____; PART_NUMBER: BRNCG0603MLC-05E; PRICE: _____; SUPPLIER: _____; TYPE: Protezione

## Net classes
0 default: width 0.203 mm, drill 0.508 mm, clearance 0.203 mm
1 power: width 0.61 mm, drill 0.508 mm, clearance 0.203 mm
2 gnd: width 0.203 mm, drill 0.508 mm, clearance 0.203 mm
3 usbvcc: width 0.305 mm, drill 0.508 mm, clearance 0.203 mm
4 aref: width 0.305 mm, drill 0.508 mm, clearance 0.203 mm